# Altium schematic sheet Board.SchDoc
size 381 x 241 mm; SheetNumber: 1; SheetTotal: 1
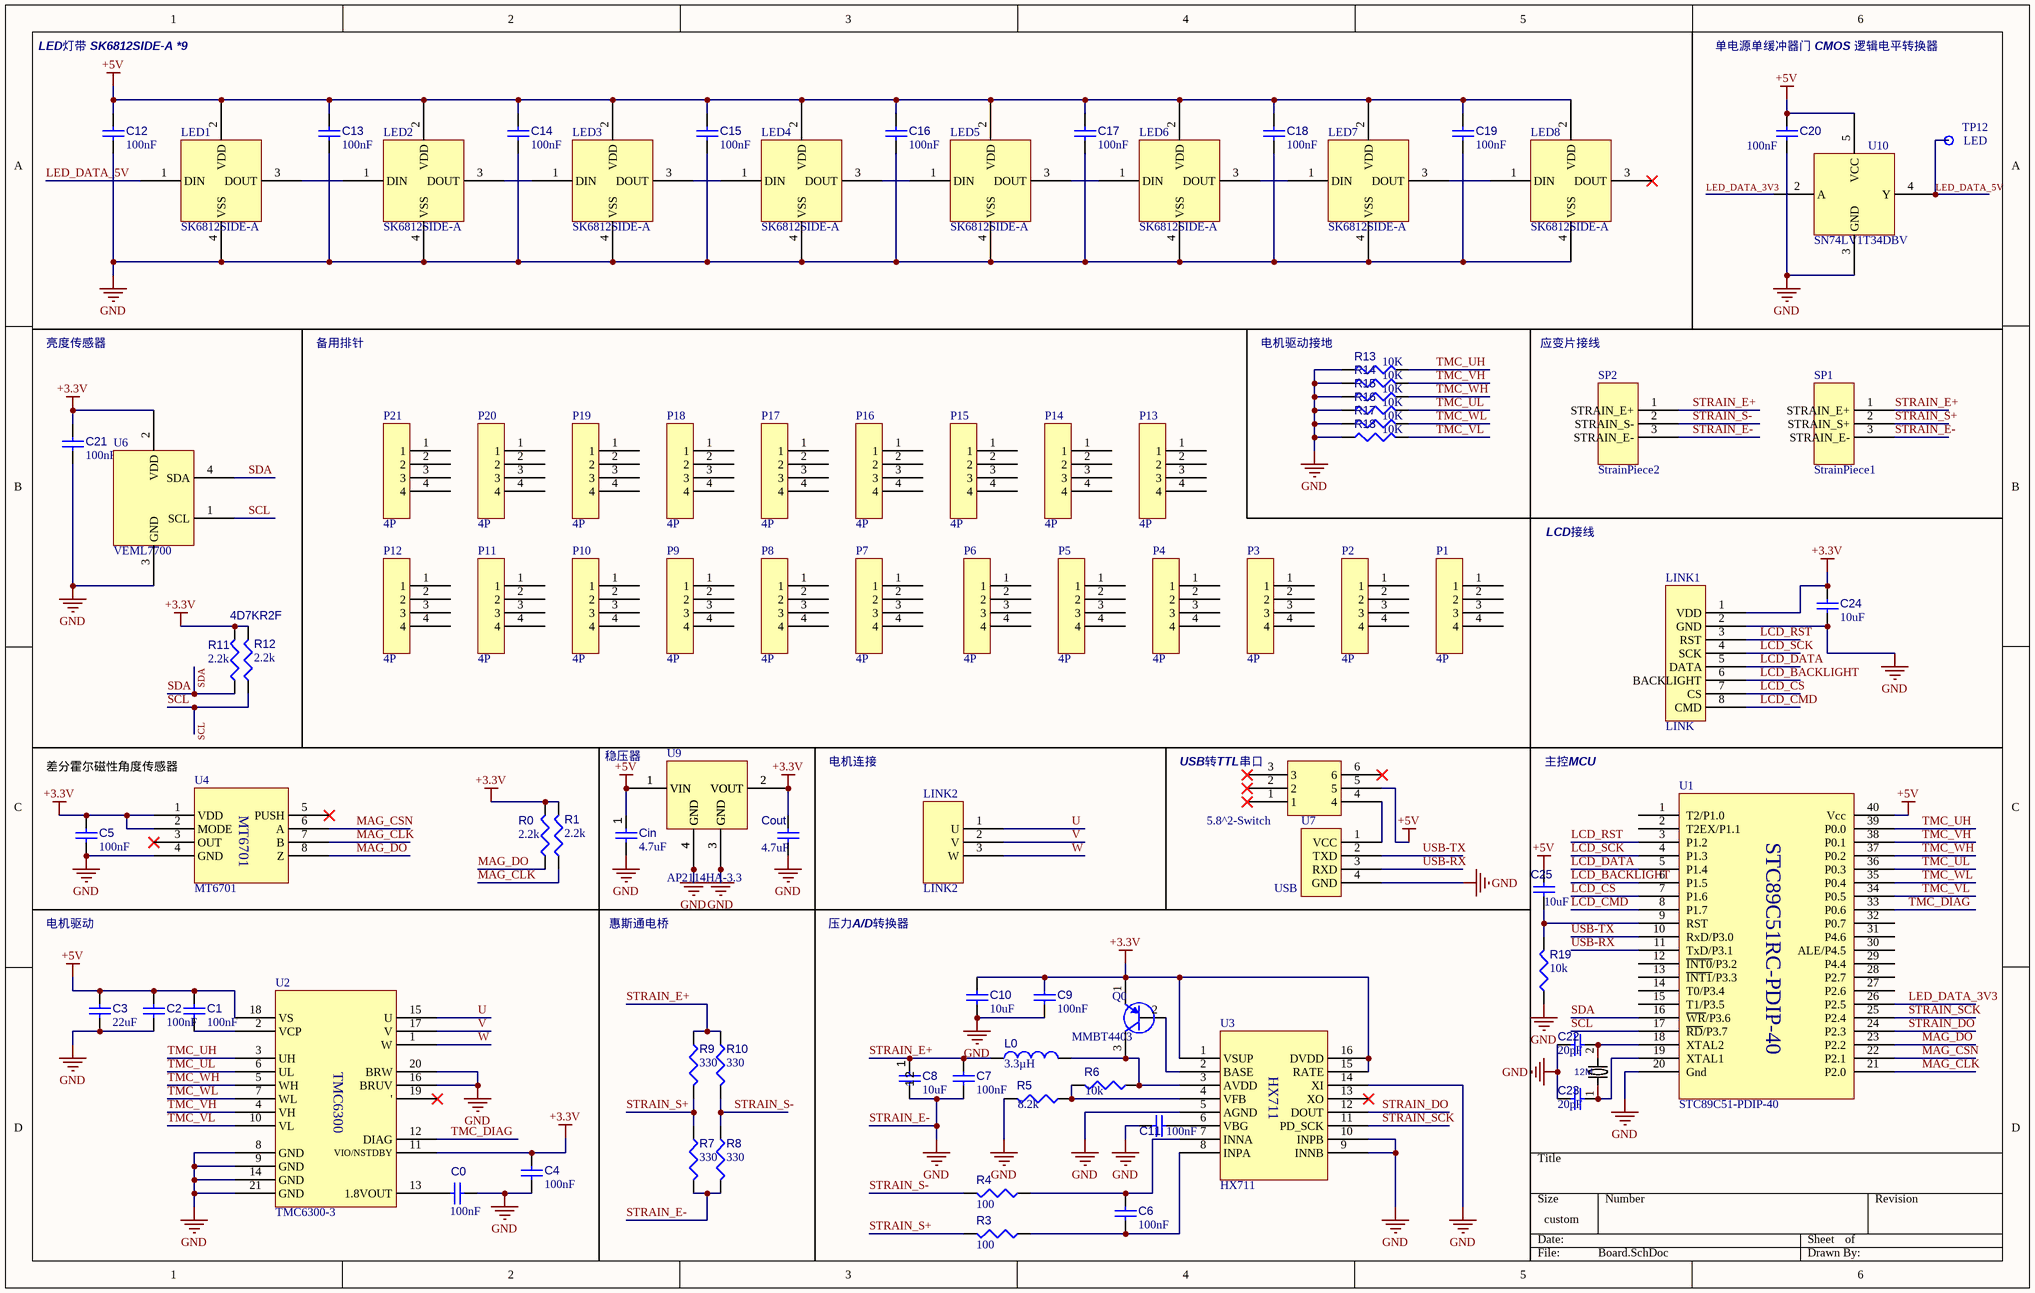
[diagram p0: Board.SchDoc]

## Parts
C0  value 100nF  [0805贴片电容]  (hidden comment: Capacitor 0.1 uF +/- 5% 16 V 0402)
C1  value 100nF  [0805贴片电容]  (hidden comment: Capacitor 0.1 uF +/- 5% 16 V 0402)
C2  value 100nF  [0805贴片电容]  (hidden comment: Capacitor 0.1 uF +/- 5% 16 V 0402)
C3  value 22uF  [0805贴片电容]  (hidden comment: Capacitor 0.1 uF +/- 5% 16 V 0402)
C4  value 100nF  [0805贴片电容]  (hidden comment: Capacitor 0.1 uF +/- 5% 16 V 0402)
C5  value 100nF  [0805贴片电容]  (hidden comment: Capacitor 0.1 uF +/- 5% 16 V 0402)
C6  value 100nF  [0805贴片电容]  (hidden comment: Capacitor 0.1 uF +/- 5% 16 V 0402)
C7  value 100nF  [0805贴片电容]  (hidden comment: Capacitor 0.1 uF +/- 5% 16 V 0402)
C8  value 10uF  [0805贴片电容]  (hidden comment: Capacitor 0.1 uF +/- 5% 16 V 0402)
C9  value 100nF  [0805贴片电容]  (hidden comment: Capacitor 0.1 uF +/- 5% 16 V 0402)
C10  value 10uF  [0805贴片电容]  (hidden comment: Capacitor 0.1 uF +/- 5% 16 V 0402)
C11  value 100nF  [0805贴片电容]  (hidden comment: Capacitor 0.1 uF +/- 5% 16 V 0402)
C12  value 100nF  [0805贴片电容]  (hidden comment: Capacitor 0.1 uF +/- 5% 16 V 0402)
C13  value 100nF  [0805贴片电容]  (hidden comment: Capacitor 0.1 uF +/- 5% 16 V 0402)
C14  value 100nF  [0805贴片电容]  (hidden comment: Capacitor 0.1 uF +/- 5% 16 V 0402)
C15  value 100nF  [0805贴片电容]  (hidden comment: Capacitor 0.1 uF +/- 5% 16 V 0402)
C16  value 100nF  [0805贴片电容]  (hidden comment: Capacitor 0.1 uF +/- 5% 16 V 0402)
C17  value 100nF  [0805贴片电容]  (hidden comment: Capacitor 0.1 uF +/- 5% 16 V 0402)
C18  value 100nF  [0805贴片电容]  (hidden comment: Capacitor 0.1 uF +/- 5% 16 V 0402)
C19  value 100nF  [0805贴片电容]  (hidden comment: Capacitor 0.1 uF +/- 5% 16 V 0402)
C20  value 100nF  [0805贴片电容]  (hidden comment: Capacitor 0.1 uF +/- 5% 16 V 0402)
C21  value 100nF  [0805贴片电容]  (hidden comment: Capacitor 0.1 uF +/- 5% 16 V 0402)
C22  value 20pF  [0805贴片电容]  (hidden comment: Capacitor 0.1 uF +/- 5% 16 V 0402)
C23  value 20pF  [0805贴片电容]  (hidden comment: Capacitor 0.1 uF +/- 5% 16 V 0402)
C24  value 10uF  [0805贴片电容]  (hidden comment: Capacitor 0.1 uF +/- 5% 16 V 0402)
C25  value 10uF  [0805贴片电容]  (hidden comment: Capacitor 0.1 uF +/- 5% 16 V 0402)
Cin  value 4.7uF  [0805贴片电容]  (hidden comment: Capacitor 0.1 uF +/- 5% 16 V 0402)
Cout  value 4.7uF  [0805贴片电容]  (hidden comment: Capacitor 0.1 uF +/- 5% 16 V 0402)
L0  value 3.3µH  [0805贴片电容]  (hidden comment: LQM2HPN1R0MJ0L)
LED1  SK6812SIDE-A  [FZ-SK6812SIDE-A]
LED2  SK6812SIDE-A  [FZ-SK6812SIDE-A]
LED3  SK6812SIDE-A  [FZ-SK6812SIDE-A]
LED4  SK6812SIDE-A  [FZ-SK6812SIDE-A]
LED5  SK6812SIDE-A  [FZ-SK6812SIDE-A]
LED6  SK6812SIDE-A  [FZ-SK6812SIDE-A]
LED7  SK6812SIDE-A  [FZ-SK6812SIDE-A]
LED8  SK6812SIDE-A  [FZ-SK6812SIDE-A]
LINK1  LINK  [LINK]
LINK2  LINK2  [LINK2]
P1  4P  [2.54管脚]
P2  4P  [2.54管脚]
P3  4P  [2.54管脚]
P4  4P  [2.54管脚]
P5  4P  [2.54管脚]
P6  4P  [2.54管脚]
P7  4P  [2.54管脚]
P8  4P  [2.54管脚]
P9  4P  [2.54管脚]
P10  4P  [2.54管脚]
P11  4P  [2.54管脚]
P12  4P  [2.54管脚]
P13  4P  [2.54管脚]
P14  4P  [2.54管脚]
P15  4P  [2.54管脚]
P16  4P  [2.54管脚]
P17  4P  [2.54管脚]
P18  4P  [2.54管脚]
P19  4P  [2.54管脚]
P20  4P  [2.54管脚]
P21  4P  [2.54管脚]
Q0  MMBT4403  [FZ-MMBT4403]
R0  value 2.2k  [0805贴片电容]  (hidden comment: 4D7KR2F)
R1  value 2.2k  [0805贴片电容]  (hidden comment: 4D7KR2F)
R3  value 100  [0805贴片电容]  (hidden comment: 4D7KR2F)
R4  value 100  [0805贴片电容]  (hidden comment: 4D7KR2F)
R5  value 8.2k  [0805贴片电容]  (hidden comment: 4D7KR2F)
R6  value 10k  [0805贴片电容]  (hidden comment: 4D7KR2F)
R7  value 330  [0805贴片电容]  (hidden comment: 4D7KR2F)
R8  value 330  [0805贴片电容]  (hidden comment: 4D7KR2F)
R9  value 330  [0805贴片电容]  (hidden comment: 4D7KR2F)
R10  value 330  [0805贴片电容]  (hidden comment: 4D7KR2F)
R11  4D7KR2F  value 2.2k  [0805贴片电容]
R12  value 2.2k  [0805贴片电容]  (hidden comment: 4D7KR2F)
R13  value 10K  [0805贴片电容]  (hidden comment: 4D7KR2F)
R14  value 10K  [0805贴片电容]  (hidden comment: 4D7KR2F)
R15  value 10K  [0805贴片电容]  (hidden comment: 4D7KR2F)
R16  value 10K  [0805贴片电容]  (hidden comment: 4D7KR2F)
R17  value 10K  [0805贴片电容]  (hidden comment: 4D7KR2F)
R18  value 10K  [0805贴片电容]  (hidden comment: 4D7KR2F)
R19  value 10k  [0805贴片电容]  (hidden comment: 4D7KR2F)
S1  5.8^2-Switch  [FZ-Switch]
SP1  StrainPiece1  [LINK2]
SP2  StrainPiece2  [LINK2]
U1  STC89C51-PDIP-40  [封装.STC89C51-PDIP-40]
U2  TMC6300-3  [封装.TMC6300]
U3  HX711  [封装.HX711]
U4  MT6701  [封装.MT6701]
U6  VEML7700  [封装.VEML7700]
U7  USB  [2.54管脚]
U9  AP2114HA-3.3  [封装.AP2114HA-3.3TRG1]
U10  SN74LV1T34DBV  [封装.SN74LV1T34DBVR]
X1  9C12000002  [HC-49S_L11.4-W4.8]  (value not drawn)

## Nets
+3.3V: C4.1 C5.1 C9.1 C10.1 C21.1 C24.2 Cout.1 LINK1.1(VDD) Q0.1(E) R0.2 R1.2 R11.2 R12.2 U2.11(VIO/NSTDBY) U3.1(VSUP) U3.15(RATE) U3.16(DVDD) U4.1(VDD) U4.2(MODE) U6.2(VDD) U9.2(VOUT)
+5V: C1.1 C2.1 C3.1 C12.1 C13.1 C14.1 C15.1 C16.1 C17.1 C18.1 C19.1 C20.1 C25.1 Cin.1 LED1.2(VDD) LED2.2(VDD) LED3.2(VDD) LED4.2(VDD) LED5.2(VDD) LED6.2(VDD) LED7.2(VDD) LED8.2(VDD) S1.5 U1.40(Vcc) U2.18(VS) U9.1(VIN) U10.5(VCC)
STRAIN_E-: C0.1 C2.2 C3.2 C4.2 C5.2 C7.2 C8.2 C9.2 C10.2 C11.1 C12.2 C13.2 C14.2 C15.2 C16.2 C17.2 C18.2 C19.2 C20.2 C21.2 C22.1 C23.1 C24.1 Cin.2 Cout.2 LED1.4(VSS) LED2.4(VSS) LED3.4(VSS) LED4.4(VSS) LED5.4(VSS) LED6.4(VSS) LED7.4(VSS) LED8.4(VSS) LINK1.2(GND) R5.2 R7.2 R8.2 R13.1 R14.1 R15.1 R16.1 R17.1 R18.1 R19.1 SP1.3(STRAIN_E-) SP2.3(STRAIN_E-) U1.20(Gnd) U2.8(GND) U2.9(GND) U2.14(GND) U2.16(BRUV) U2.20(BRW) U2.21(GND) U3.5(AGND) U3.9(INNB) U3.10(INPB) U3.14(XI) U4.4(GND) U6.3(GND) U7.4(GND) U9.3(GND) U9.4(GND) U10.3(GND)  [also labelled GND]
LCD_BACKLIGHT: LINK1.6(BACKLIGHT) U1.6(P1.5)
LCD_CMD: LINK1.8(CMD) U1.8(P1.7)
LCD_CS: LINK1.7(CS) U1.7(P1.6)
LCD_DATA: LINK1.5(DATA) U1.5(P1.4)
LCD_RST: LINK1.3(RST) U1.3(P1.2)
LCD_SCK: LINK1.4(SCK) U1.4(P1.3)
LED_DATA_3V3: U1.26(P2.5) U10.2(A)
LED_DATA_5V: LED1.1(DIN) U10.4(Y)
MAG_CLK: R1.1 U1.21(P2.0) U4.7(B)
MAG_CSN: U1.22(P2.1) U4.6(A)
MAG_DO: R0.1 U1.23(P2.2) U4.8(Z)
SCL: R12.1 U1.17(~{RD}/P3.7) U6.1(SCL)
SDA: R11.1 U1.16(~{WR}/P3.6) U6.4(SDA)
STRAIN_DO: U1.24(P2.3) U3.12(DOUT)
STRAIN_E+: C7.1 C8.1 L0.1 R9.1 R10.1 SP1.1(STRAIN_E+) SP2.1(STRAIN_E+)
STRAIN_S+: R3.2 R7.1 R9.2 SP1.2(STRAIN_S+)
STRAIN_S-: R4.2 R8.1 R10.2 SP2.2(STRAIN_S-)
STRAIN_SCK: U1.25(P2.4) U3.11(PD_SCK)
TMC_DIAG: U1.33(P0.6) U2.12(DIAG)
TMC_UH: R13.2 U1.39(P0.0) U2.3(UH)
TMC_UL: R16.2 U1.36(P0.3) U2.6(UL)
TMC_VH: R14.2 U1.38(P0.1) U2.4(VH)
TMC_VL: R18.2 U1.34(P0.5) U2.10(VL)
TMC_WH: R15.2 U1.37(P0.2) U2.5(WH)
TMC_WL: R17.2 U1.35(P0.4) U2.7(WL)
U: LINK2.1(U) U2.15(U)
USB-RX: U1.11(TxD/P3.1) U7.3(RXD)
USB-TX: U1.10(RxD/P3.0) U7.2(TXD)
V: LINK2.2(V) U2.17(V)
W: LINK2.3(W) U2.1(W)
NetC0_2: C0.2 U2.13(1.8VOUT)
NetC1_2: C1.2 U2.2(VCP)
NetC6_1: C6.1 R4.1 U3.7(INNA)
NetC6_2: C6.2 R3.1 U3.8(INPA)
NetC11_2: C11.2 U3.6(VBG)
NetC22_2: C22.2 U1.18(XTAL2) X1.2
NetC23_2: C23.2 U1.19(XTAL1) X1.1
NetC25_2: C25.2 R19.2 U1.9(RST)
NetL0_2: L0.2 Q0.3(C) R6.1 U3.3(AVDD)
NetLED1_3: LED1.3(DOUT) LED2.1(DIN)
NetLED2_3: LED2.3(DOUT) LED3.1(DIN)
NetLED3_3: LED3.3(DOUT) LED4.1(DIN)
NetLED4_3: LED4.3(DOUT) LED5.1(DIN)
NetLED5_3: LED5.3(DOUT) LED6.1(DIN)
NetLED6_3: LED6.3(DOUT) LED7.1(DIN)
NetLED7_3: LED7.3(DOUT) LED8.1(DIN)
NetQ0_2: Q0.2(B) U3.2(BASE)
NetR5_1: R5.1 R6.2 U3.4(VFB)
NetS1_4: S1.4 U7.1(VCC)

Not connected (* = marked no-connect by the designer): LED8 3(DOUT)*; P1 1 2 3 4; P2 1 2 3 4; P3 1 2 3 4; P4 1 2 3 4; P5 1 2 3 4; P6 1 2 3 4; P7 1 2 3 4; P8 1 2 3 4; P9 1 2 3 4; P10 1 2 3 4; P11 1 2 3 4; P12 1 2 3 4; P13 1 2 3 4; P14 1 2 3 4; P15 1 2 3 4; P16 1 2 3 4; P17 1 2 3 4; P18 1 2 3 4; P19 1 2 3 4; P20 1 2 3 4; P21 1 2 3 4; S1 1* 2* 3* 6*; U1 1(T2/P1.0) 2(T2EX/P1.1) 12(~{INT0}/P3.2) 13(~{INT1}/P3.3) 14(T0/P3.4) 15(T1/P3.5) 27(P2.6) 28(P2.7) 29(P4.4) 30(ALE/P4.5) 31(P4.6) 32(P0.7); U2 19(')*; U3 13(XO)*; U4 3(OUT)* 5(PUSH)*

## Notes on the sheet
- LED灯带 SK6812SIDE-A *9
- 单电源单缓冲器门 CMOS 逻辑电平转换器
- TP12
- LED
- 亮度传感器
- 备用排针
- 电机驱动接地
- 应变片接线
- LCD接线
- 差分霍尔磁性角度传感器
- 稳压器
- 电机连接
- (near S1) USB转TTL串口
- 主控MCU
- 电机驱动
- 惠斯通电桥
- 压力A/D转换器
- (near X1) 12M
- (in symbol CMP-007-000098-1) STC89C51RC-PDIP-40
- (in symbol CMP-007-000236-1) TMC6300

## Library data of the parts
C0-C25 Cin Cout = CAP-NP-2: Chip Capacitor, 0.1 uF, +/- 5%, 16 V, 0402 (1005 Metric); Capacitor Type: Ceramic; Voltage Rating: 16V; Max Operating Temperature: 125°C; Min Operating Temperature: -55°C; Case/Package: 0402; Mounting Technology: SM; Pins: 2; Tolerance: 5%; RoHS Compliant: True
L0 = CMP-006-00008-6: Chip Inductor, 1 uH, +/- 20%, 1 MHz, -55 to 125 degC, 1008 (2520 Metric), RoHS, Tape and Reel; Manufacturer: Murata; Self Resonant Frequency: 70MHz; Current Rating: 1.5A; Shielding: Shielded; Core Material: Ferrite; Resistance: 0.09Ohm; Datasheet URL: http://psearch.en.murata.com/inductor/product/LQM2HPN1R0MJ0%23.pdf; Datasheet Version: Aug-16; RoHS Compliant: True; Case/Package: 1008; Package Description: 2-Pin Surface Mount Device, Body 2.5 x 2 mm; Package Quantity: 3000; Tolerance: 20%; Min Operating Temperature: -40°C; Package Reference: 1008; Packaging: TapeandReel; Mounting Technology: SM; Max Operating Temperature: 85°C
LED1-LED8 = CMP-007-000137-1: Source: IC.SchLib; Design Item ID: SK6812SIDE-A
LINK1 = CMP-014-000001-1: Design Item ID: LINK; Source: Board.SchLib
LINK2 = CMP-014-000018-1: Design Item ID: LINK2; Source: Board.SchLib
P1-P21 = CMP-014-000031-1: Source: Board.SchLib; Design Item ID: 4P
Q0 = CMP-013-00004-3: Manufacturer: Unisonic; Mounting Technology: TH; Package Description: 3-Pin Through Hole Device, Dia 4.58 mm, Pitch 1.27 mm; Datasheet URL: http://media.nkcelectronics.com/datasheet/s8550.pdf; Case/Package: TO-92-3; Datasheet Version: Rev. E, 06/2014; Package Reference: TO-92-3; RoHS Compliant: Unknown
R0 R1 R3-R10 R12-R19 = CMP-009-00105-2: 4K7 0.063W 1% 0402 (1005 Metric)  SMD; Power: 63mW; Mounting Technology: SMT; Case/Package: 0402; Tolerance: 1%; Pins: 2
R11 = CMP-009-00105-2: Tolerance: 1%; Power: 63mW; Mounting Technology: SMT; Case/Package: 0402; Pins: 2
S1 = CMP-011-00013-1: Device: 5.8 ZSPT; Designer: U?; Design Item ID: 5.8^2-Switch; Source: IC.SchLib; Symbol: 5.8 ZSPT
SP1 = CMP-014-000027-1: Source: Board.SchLib; Design Item ID: StrainPiece1
SP2 = CMP-014-000028-1: Design Item ID: StrainPiece2; Source: Board.SchLib
U1 = CMP-007-000098-1: 主控MCU; Source: IC.SchLib; Design Item ID: STC89C51-PDIP-40
U2 = CMP-007-000236-1: Design Item ID: TMC6300-3; Source: IC.SchLib
U3 = CMP-007-000093-1: 压力模数转换器; Source: IC.SchLib; Design Item ID: HX711
U4 = CMP-007-000116-1: 霍尔传感器; Design Item ID: MT6701; Source: IC.SchLib
U6 = CMP-007-000095-1: 感光想读传感器; Design Item ID: VEML7700; Source: IC.SchLib
U7 = CMP-007-000053-1: Source: IC.SchLib; Design Item ID: USB
U9 = CMP-007-000082-1: 电压控制器; Design Item ID: AP2114HA-3.3; Source: IC.SchLib
U10 = CMP-007-000097-1: 电流放大器; Design Item ID: SN74LV1T34DBV; Source: IC.SchLib
X1 = CMP-007-000156-1: Manufacturer: TXC(晶技); Convert to PCB: yes; Symbol: 9C1202LCSC-DDK2S; LCSC Part Name: SMD HC-49S 12M 49SMD 20pF 20ppm 30R 0~70℃; Value: -; Load Capacitance: -; Supplier Part: C90939; Crystal Type: -; Device: 9C12000002; Operating Temperature: -; JLCPCB Part Class: Extended Part; Add into BOM: yes; Supplier Footprint: HC-49S-SMD; Design Item ID: 9C12000002; Source: IC.SchLib; Manufacturer Part: 9C12000002; Datasheet: https://atta.szlcsc.com/upload/public/pdf/source/20161217/1481939208787.pdf